# EAGLE design battery_monitor_6803-2_Rev5 (EAGLE 7.3.0)
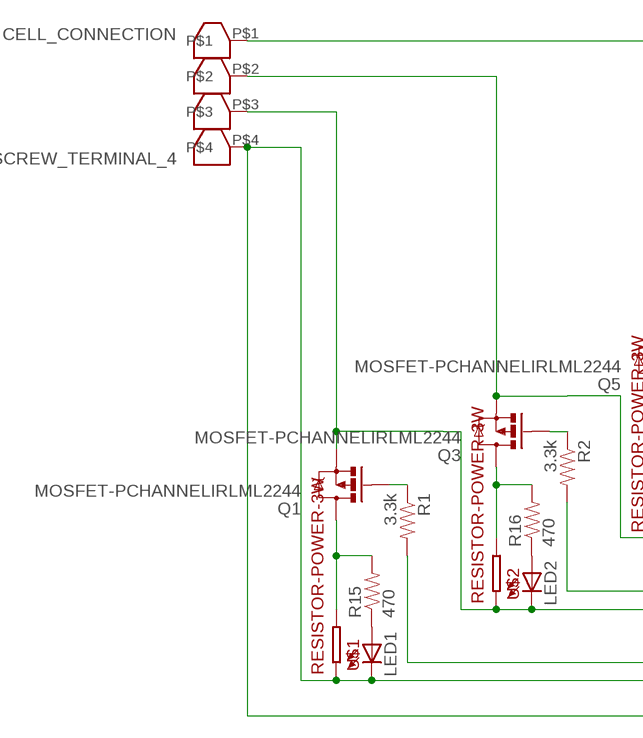
[diagram p0: schematic, sheet 1, part 1 of 2]
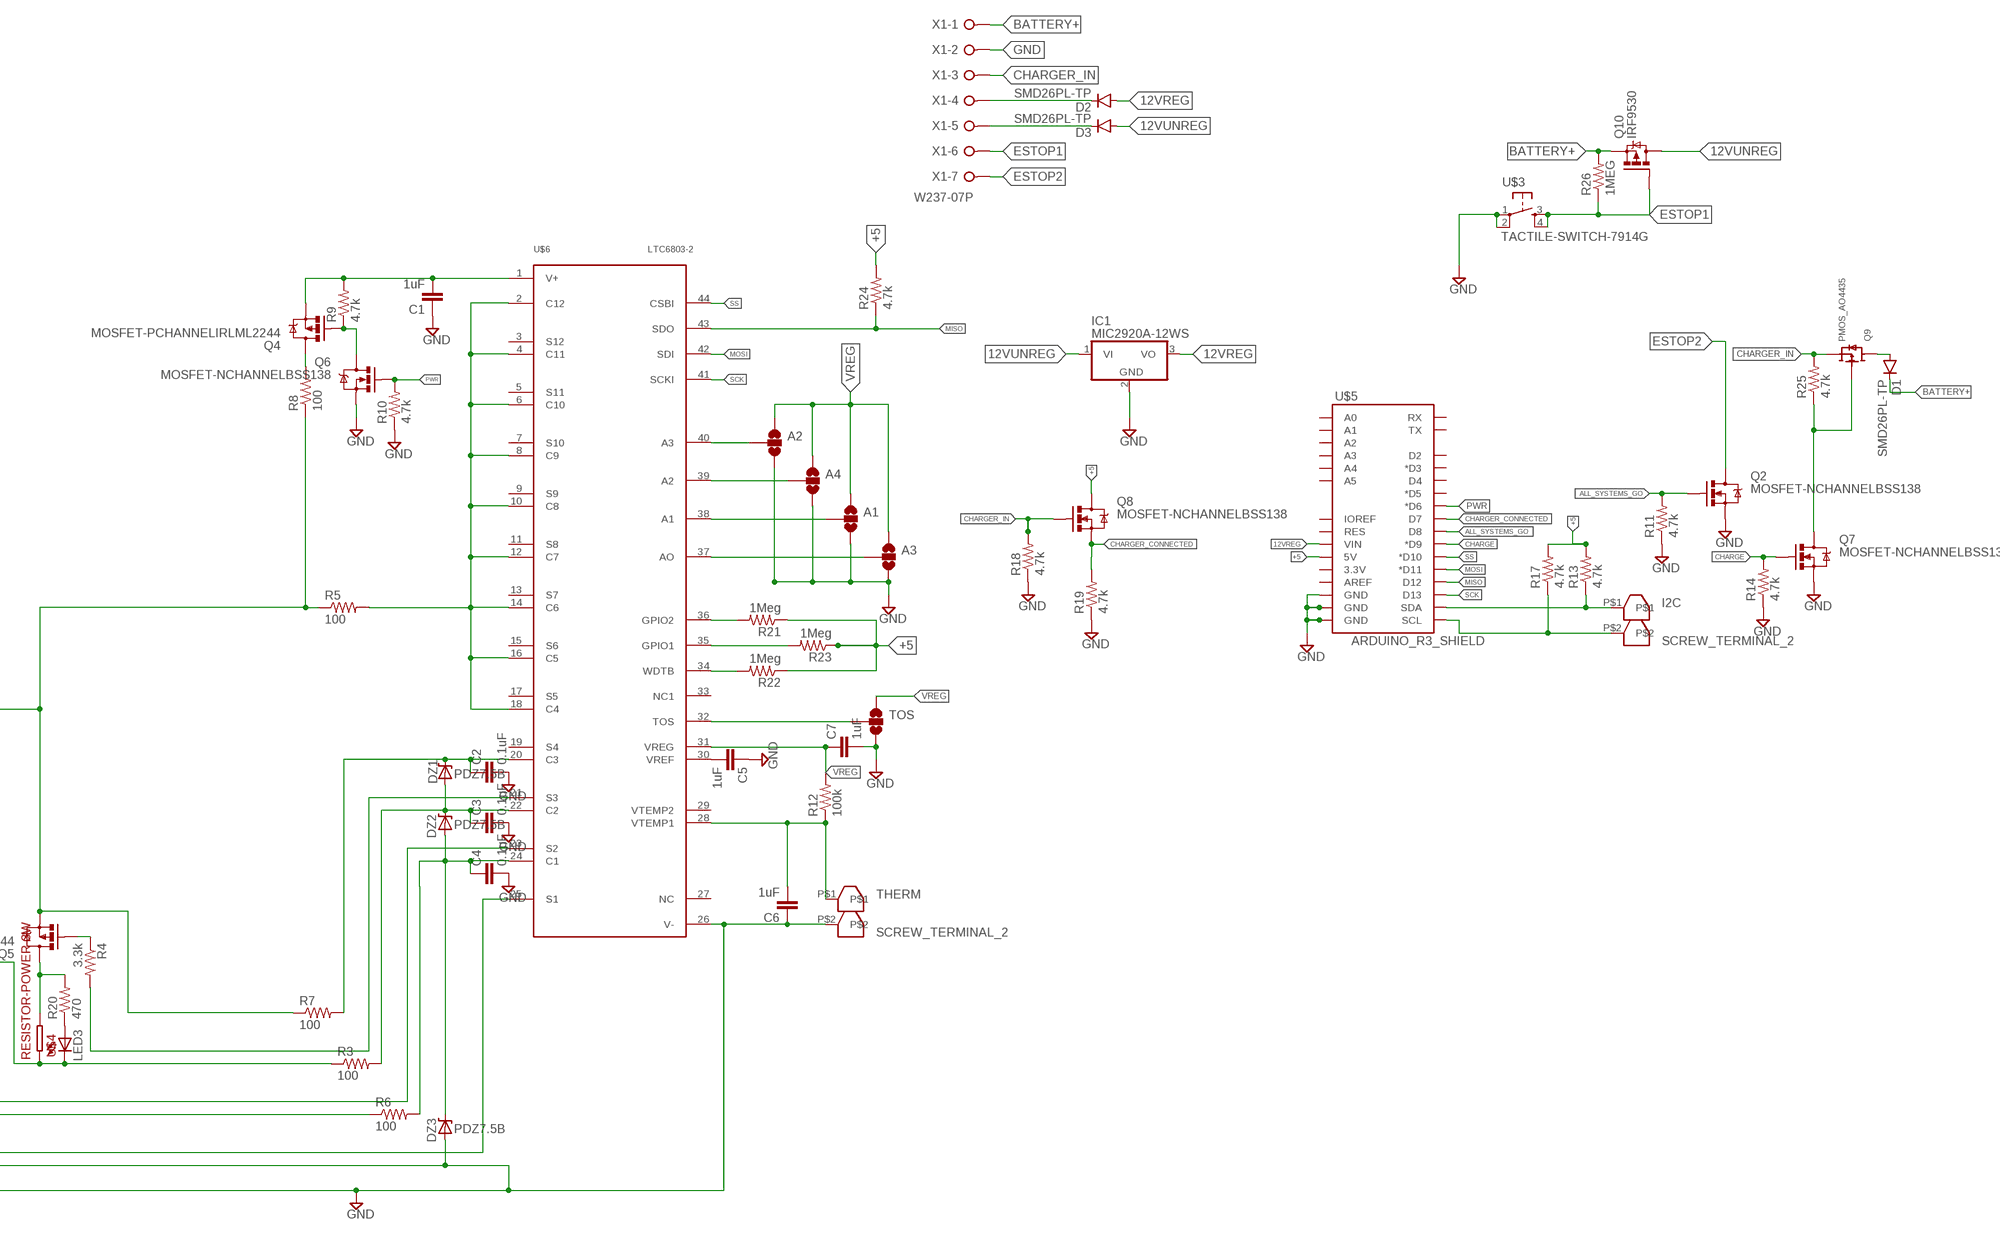
[diagram p1: schematic, sheet 1, part 2 of 2]

## Parts
A1  SOLDERJUMPER_2WAYS  [SJ_3]
A2  SOLDERJUMPER_2WAYS  [SJ_3]
A3  SOLDERJUMPER_2WAYS  [SJ_3]
A4  SOLDERJUMPER_2WAYS  [SJ_3]
C1  1uF  0.1UF-100V-10%(0603)  [0603-CAP]
C2  0.1uF  0.1UF-100V-10%(0603)  [0603-CAP]
C3  0.1uF  0.1UF-100V-10%(0603)  [0603-CAP]
C4  0.1uF  0.1UF-100V-10%(0603)  [0603-CAP]
C5  1uF  0.1UF-100V-10%(0603)  [0603-CAP]
C6  1uF  0.1UF-100V-10%(0603)  [0603-CAP]
C7  1uF  0.1UF-100V-10%(0603)  [0603-CAP]
CELL_CONNECTION  SCREW_TERMINAL_4  [SCREW_TERMINAL_4]
D1  SMD26PL-TP  DIODESOD123  [SOD-123]
D2  SMD26PL-TP  DIODESOD123  [SOD-123]
D3  SMD26PL-TP  DIODESOD123  [SOD-123]
DZ1  PDZ7.5B  DIODE-ZENER-BZT52  [SOD-323@1]
DZ2  PDZ7.5B  DIODE-ZENER-BZT52  [SOD-323@1]
DZ3  PDZ7.5B  DIODE-ZENER-BZT52  [SOD-323@1]
I2C  SCREW_TERMINAL_2  [SCREW_TERMINAL_2]
IC1  MIC2920A-12WS  MCP1703DB  [SOT223]
LED1  LED0603  [LED-0603]
LED2  LED0603  [LED-0603]
LED3  LED0603  [LED-0603]
Q1  MOSFET-PCHANNELIRLML2244  [SOT23-3@1]
Q2  MOSFET-NCHANNELBSS138  [SOT23]
Q3  MOSFET-PCHANNELIRLML2244  [SOT23-3@1]
Q4  MOSFET-PCHANNELIRLML2244  [SOT23-3@1]
Q5  MOSFET-PCHANNELIRLML2244  [SOT23-3@1]
Q6  MOSFET-NCHANNELBSS138  [SOT23]
Q7  MOSFET-NCHANNELBSS138  [SOT23]
Q8  MOSFET-NCHANNELBSS138  [SOT23]
Q9  PMOS_AO4435  [SOIC8]
Q10  IRF9530  [TO220BV]
R1  3.3k  3.3KOHM1/10W1%(0603)  [0603-RES]
R2  3.3k  3.3KOHM1/10W1%(0603)  [0603-RES]
R3  100  3.3KOHM1/10W1%(0603)  [0603-RES]
R4  3.3k  3.3KOHM1/10W1%(0603)  [0603-RES]
R5  100  3.3KOHM1/10W1%(0603)  [0603-RES]
R6  100  3.3KOHM1/10W1%(0603)  [0603-RES]
R7  100  3.3KOHM1/10W1%(0603)  [0603-RES]
R8  100  3.3KOHM1/10W1%(0603)  [0603-RES]
R9  4.7k  3.3KOHM1/10W1%(0603)  [0603-RES]
R10  4.7k  3.3KOHM1/10W1%(0603)  [0603-RES]
R11  4.7k  3.3KOHM1/10W1%(0603)  [0603-RES]
R12  100k  3.3KOHM1/10W1%(0603)  [0603-RES]
R13  4.7k  3.3KOHM1/10W1%(0603)  [0603-RES]
R14  4.7k  3.3KOHM1/10W1%(0603)  [0603-RES]
R15  470  3.3KOHM1/10W1%(0603)  [0603-RES]
R16  470  3.3KOHM1/10W1%(0603)  [0603-RES]
R17  4.7k  3.3KOHM1/10W1%(0603)  [0603-RES]
R18  4.7k  3.3KOHM1/10W1%(0603)  [0603-RES]
R19  4.7k  3.3KOHM1/10W1%(0603)  [0603-RES]
R20  470  3.3KOHM1/10W1%(0603)  [0603-RES]
R21  1Meg  3.3KOHM1/10W1%(0603)  [0603-RES]
R22  1Meg  3.3KOHM1/10W1%(0603)  [0603-RES]
R23  1Meg  3.3KOHM1/10W1%(0603)  [0603-RES]
R24  4.7k  3.3KOHM1/10W1%(0603)  [0603-RES]
R25  4.7k  3.3KOHM1/10W1%(0603)  [0603-RES]
R26  1MEG  3.3KOHM1/10W1%(0603)  [0603-RES]
THERM  SCREW_TERMINAL_2  [SCREW_TERMINAL_2]
TOS  SOLDERJUMPER_2WAYS  [SJ_3]
U$1  RESISTOR-POWER-3W  [RESISTOR-3W]
U$2  RESISTOR-POWER-3W  [RESISTOR-3W]
U$3  TACTILE-SWITCH-7914G  [7914G]
U$4  RESISTOR-POWER-3W  [RESISTOR-3W]
U$5  ARDUINO_R3_SHIELD  [UNO_R3_SHIELD]
U$6  LTC6803-2  [FSOP-44]
X1  W237-07P  [W237-7P]

## Nets
12VREG: D2.A IC1.3(VO) U$5.VIN
12VUNREG: D3.A IC1.1(VI) Q10.D
+5: Q8.3(D) R13.2 R17.2 R21.1 R22.1 R23.1 R24.2 U$5.5V
ALL_SYSTEMS_GO: Q2.1(G) R11.2 U$5.D8
BATTERY+: D1.C Q10.S R26.2 X1.1
CHARGE: Q7.1(G) R14.2 U$5.D9(*D9)
CHARGER_CONNECTED: Q8.2(S) R19.2 U$5.D7
CHARGER_IN: Q8.1(G) Q9.1(SOURCE) Q9.2(SOURCE) Q9.3(SOURCE) R18.2 R25.2 X1.3
ESTOP1: Q10.G R26.1 U$3.3 U$3.4 X1.6
ESTOP2: Q2.3(D) X1.7
GND: A1.3 A2.3 A3.3 A4.3 C1.1 C2.2 C3.2 C4.2 C5.1 C6.1 C7.2 CELL_CONNECTION.P$4 DZ3.2(A) IC1.2(GND) LED1.C Q2.2(S) Q6.2(S) Q7.2(S) R10.1 R11.1 R14.1 R18.1 R19.1 THERM.P$2 TOS.3 U$1.P$2 U$3.1 U$3.2 U$5.GND@0(GND) U$5.GND@1(GND) U$5.GND@2(GND) U$6.26(V-) X1.2
MISO: R24.1 U$5.D12 U$6.43(SDO)
MOSI: U$5.D11(*D11) U$6.42(SDI)
N$1: Q7.3(D) Q9.4(GATE) R25.1
N$2: CELL_CONNECTION.P$3 LED2.C Q1.2(S) R6.1 U$2.P$2
N$3: CELL_CONNECTION.P$2 LED3.C Q3.2(S) R3.1 U$4.P$2
N$4: CELL_CONNECTION.P$1 Q5.2(S) R5.1 R7.1 R8.1
N$5: Q1.3(D) R15.2 U$1.P$1
N$6: R2.2 U$6.23(S2)
N$7: Q1.1(G) R1.1
N$8: R1.2 U$6.25(S1)
N$9: R4.2 U$6.21(S3)
N$10: Q3.3(D) R16.2 U$2.P$1
N$11: Q3.1(G) R2.1
N$12: Q5.3(D) R20.2 U$4.P$1
N$13: LED1.A R15.1
N$14: C2.1 DZ1.1(C) R7.2 U$6.20(C3)
N$15: C4.1 DZ2.2(A) DZ3.1(C) R6.2 U$6.24(C1)
N$16: C3.1 DZ1.2(A) DZ2.1(C) R3.2 U$6.22(C2)
N$17: R5.2 U$6.2(C12) U$6.4(C11) U$6.6(C10) U$6.8(C9) U$6.10(C8) U$6.12(C7) U$6.14(C6) U$6.16(C5) U$6.18(C4)
N$18: Q4.3(D) R8.2
N$19: C1.2 Q4.2(S) R9.2 U$6.1(V+)
N$20: Q4.1(G) Q6.3(D) R9.1
N$21: C6.2 R12.1 THERM.P$1 U$6.28(VTEMP1)
N$22: LED2.A R16.1
N$23: LED3.A R20.1
N$24: R21.2 U$6.36(GPIO2)
N$25: R23.2 U$6.35(GPIO1)
N$26: D3.C X1.5
N$27: R22.2 U$6.34(WDTB)
N$28: A2.2 U$6.40(A3)
N$29: Q5.1(G) R4.1
N$30: A4.2 U$6.39(A2)
N$31: A1.2 U$6.38(A1)
N$32: A3.2 U$6.37(AO)
N$33: TOS.2 U$6.32(TOS)
N$34: C5.2 U$6.30(VREF)
N$$8: D1.A Q9.5(DRAIN) Q9.6(DRAIN) Q9.7(DRAIN) Q9.8(DRAIN)
PWR: Q6.1(G) R10.2 U$5.D6(*D6)
SCK: U$5.D13 U$6.41(SCKI)
SCL: I2C.P$2 R17.1 U$5.SCL
SDA: I2C.P$1 R13.1 U$5.SDA
SS: U$5.D10(*D10) U$6.44(CSBI)
VREG: A1.1 A2.1 A3.1 A4.1 C7.1 R12.2 TOS.1 U$6.31(VREG)
WIRE: D2.C X1.4
Unconnected: U$5.3.3V U$5.A0 U$5.A1 U$5.A2 U$5.A3 U$5.A4 U$5.A5 U$5.AREF U$5.D2 U$5.D3(*D3) U$5.D4 U$5.D5(*D5) U$5.IOREF U$5.RES U$5.RX U$5.TX U$6.3(S12) U$6.5(S11) U$6.7(S10) U$6.9(S9) U$6.11(S8) U$6.13(S7) U$6.15(S6) U$6.17(S5) U$6.19(S4) U$6.27(NC) U$6.29(VTEMP2) U$6.33(NC1)

## Library data of the parts
A1-A4 TOS = SparkFun:SOLDERJUMPER_2WAY: Solder Jumper 2 way solder jumper; OC_NEWARK: unknown
C1 C5-C7 = SparkFun-Capacitors:0.1UF-100V-10%(0603): CAP-08390; MPN: C0603X5R0J105M030BC; OC_NEWARK: 04X3184; PROD_ID: CAP-08390; VALUE: 0.1uF
C2-C4 = SparkFun-Capacitors:0.1UF-100V-10%(0603): CAP-08390; MF: AVX CORPORATION; MPN: 0603YG104ZAT2A; OC_NEWARK: 01H6821; PROD_ID: CAP-08390
CELL_CONNECTION = isaac1:SCREW_TERMINAL_4; MF: TYCO ELECTRONICS; MPN: 282834-4; OC_NEWARK: 12H8388
D1-D3 = SparkFun-DiscreteSemi:DIODE: Diode These are standard reverse protection diodes and small signal diodes. SMA package can handle up to about 1A. SOD-323 can handle about 200mA. What the SOD-323 package when ordering, there are some mfgs out there that are 5-pin packages.
DZ1-DZ3 = SparkFun-DiscreteSemi:DIODE-ZENER: Zener Diode Production Part - 8199 3.4V Zener Voltage; MPN: PDZ7.5B,115; OC_NEWARK: 04X4941
I2C THERM = isaac1:SCREW_TERMINAL_2; MF: TYCO ELECTRONICS; MPN: 282834-2; OC_NEWARK: 12H8386
IC1 = linear:MCP1703: 250 mA, 16V, Low Quiescent Current LDO Regulator Source: http://ww1.microchip.com/downloads/en/DeviceDoc/22049b.pdf
LED1-LED3 = SparkFun-LED:LED: LEDs Standard schematic elements and footprints for 5mm, 3mm, 1206, and 0603 sized LEDs. 5mm - Spark Fun Electronics SKU : COM-00529 (and others); MPN: 150060RS75000; OC_NEWARK: 95W3795
Q1 Q3-Q5 = SparkFun-DiscreteSemi:MOSFET-PCHANNEL: Generic PMOSFET; MPN: SI2369DS-T1-GE3; OC_NEWARK: 40X8697; PROD_ID: TRANS-11153
Q2 Q6-Q8 = SparkFun-DiscreteSemi:MOSFET-NCHANNEL: Common NMOSFET Parts MFG P/N Store ID Prod ID FDD8780 TRANS-09984 SI7820DN TRANS-11055 FDS6630A IC-08089 2N7002PW TRANS-11151 FQP30N06L COM-10213 TRANS-10060 BSS123LT1G TRANS-08345 BSS138 TRANS-00830 BS170 2N7000; MPN: IRLML0030TRPBF; OC_NEWARK: 52R2613; PROD_ID: TRANS-00830
Q9 = isaac1:PMOS_AO4435; MPN: SI9407BDY-T1-GE3; OC_NEWARK: 16P3885
Q10 = Adams Chips:IRF9530: P-CHANNEL HEXFET POWER-MOS-FET Source: http://www.irf.com/product-info/datasheets/data/irf9530.pdf; MPN: NTE2383; OC_NEWARK: 14T4215
R1 R2 R4 = SparkFun-Resistors:3.3KOHM1/10W1%(0603): RES-07851; MF: VISHAY/DALE; MPN: CRCW06033K00FKEA; OC_NEWARK: 52K8368; PROD_ID: RES-07851
R3 R5-R8 = SparkFun-Resistors:3.3KOHM1/10W1%(0603): RES-07851; MPN: ERJ-1GNF1000C; OC_NEWARK: 05X8794; PROD_ID: RES-07851
R9-R11 R13 R14 R17-R19 R24 R25 = SparkFun-Resistors:3.3KOHM1/10W1%(0603): RES-07851; MF: VISHAY/DALE; MPN: CRCW06034K70FKEA; OC_NEWARK: 52K8494; PROD_ID: RES-07851
R12 = SparkFun-Resistors:3.3KOHM1/10W1%(0603): RES-07851; MF: FARNELL; MPN: MC0063W06035100K; OC_NEWARK: 39K0075; PROD_ID: RES-07851
R15 R16 R20 = SparkFun-Resistors:3.3KOHM1/10W1%(0603): RES-07851; MPN: ERJ-P03F4700V; OC_NEWARK: 05X8640; PROD_ID: RES-07851
R21-R23 R26 = SparkFun-Resistors:3.3KOHM1/10W1%(0603): RES-07851; MPN: ERJ-3EKF1004V; OC_NEWARK: 64R5311; PROD_ID: RES-07851
U$1 U$2 U$4 = isaac1:RESISTOR-POWER-3W: PR03 series .205" dia x .657" L; MPN: ERG-3SJ200; OC_NEWARK: 52W7905
U$3 = GeekAmmo:TACTILE-SWITCH: Tactile Switch 4 Pins, SPST NO; MF: BOURNS, INC.; MPN: 7914G-1-000E; OC_NEWARK: 05B2757
U$5 = SparkFun-Boards:ARDUINO_R3_SHIELD: Shield form compatible with the Arduino Uno R3.; OC_NEWARK: unknown
U$6 = isaac1:LTC6803-2; OC_NEWARK: unknown
X1 = con-wago-508:W237-07P: WAGO SREW CLAMP; OC_FARNELL: unknown; OC_NEWARK: unknown

## Board
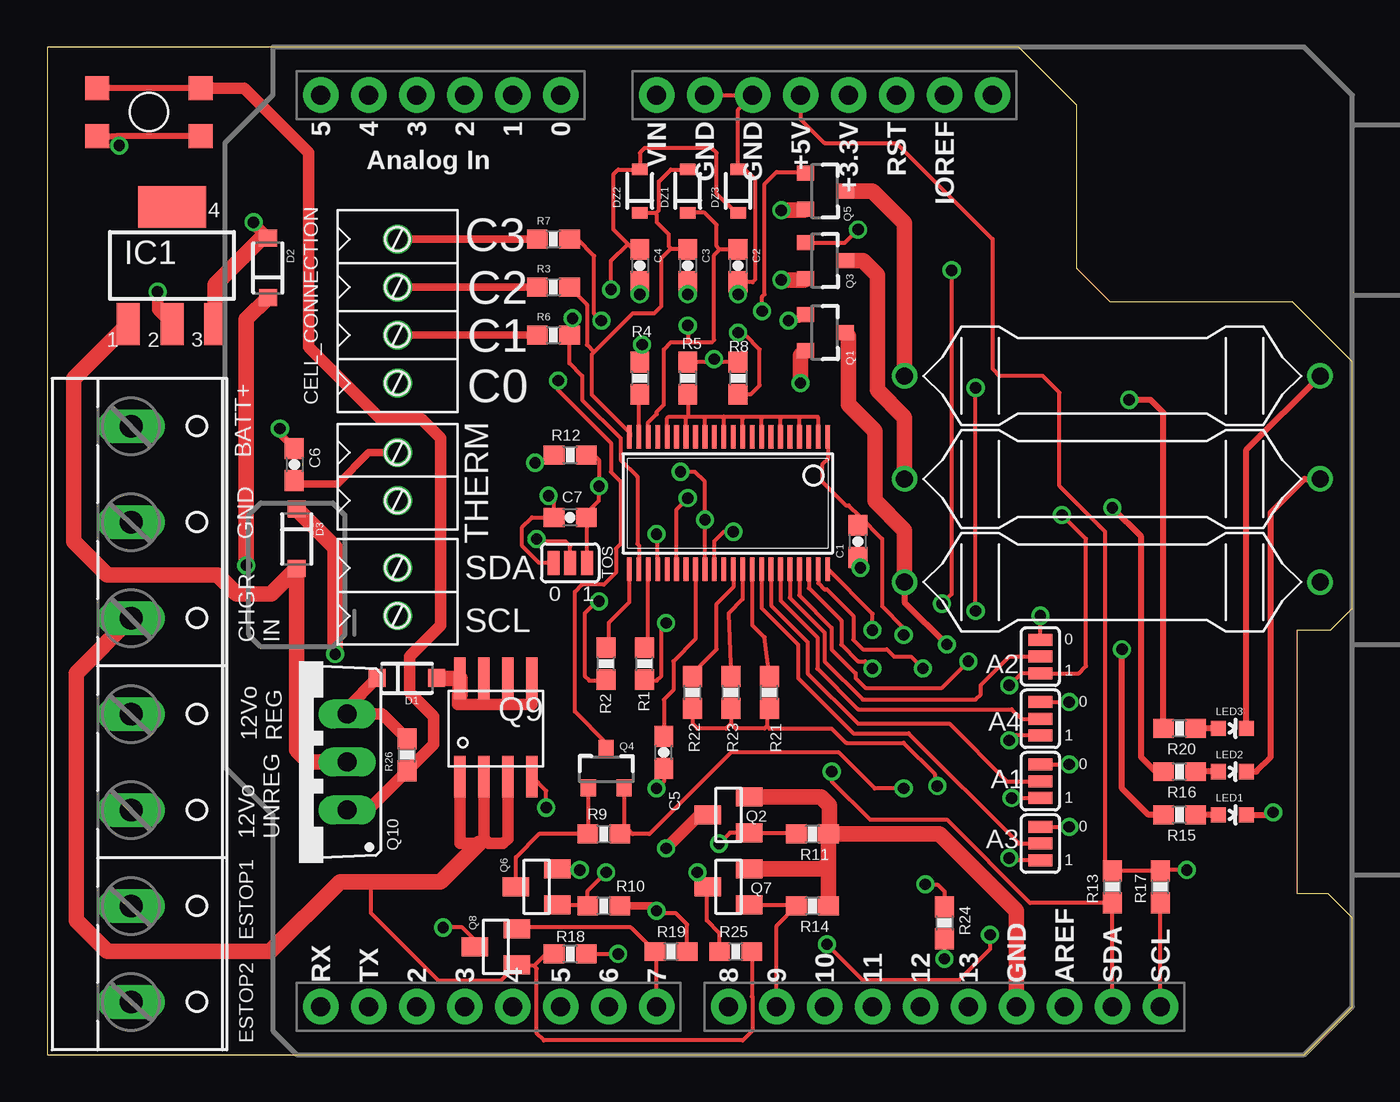
[diagram p2: board, top side]
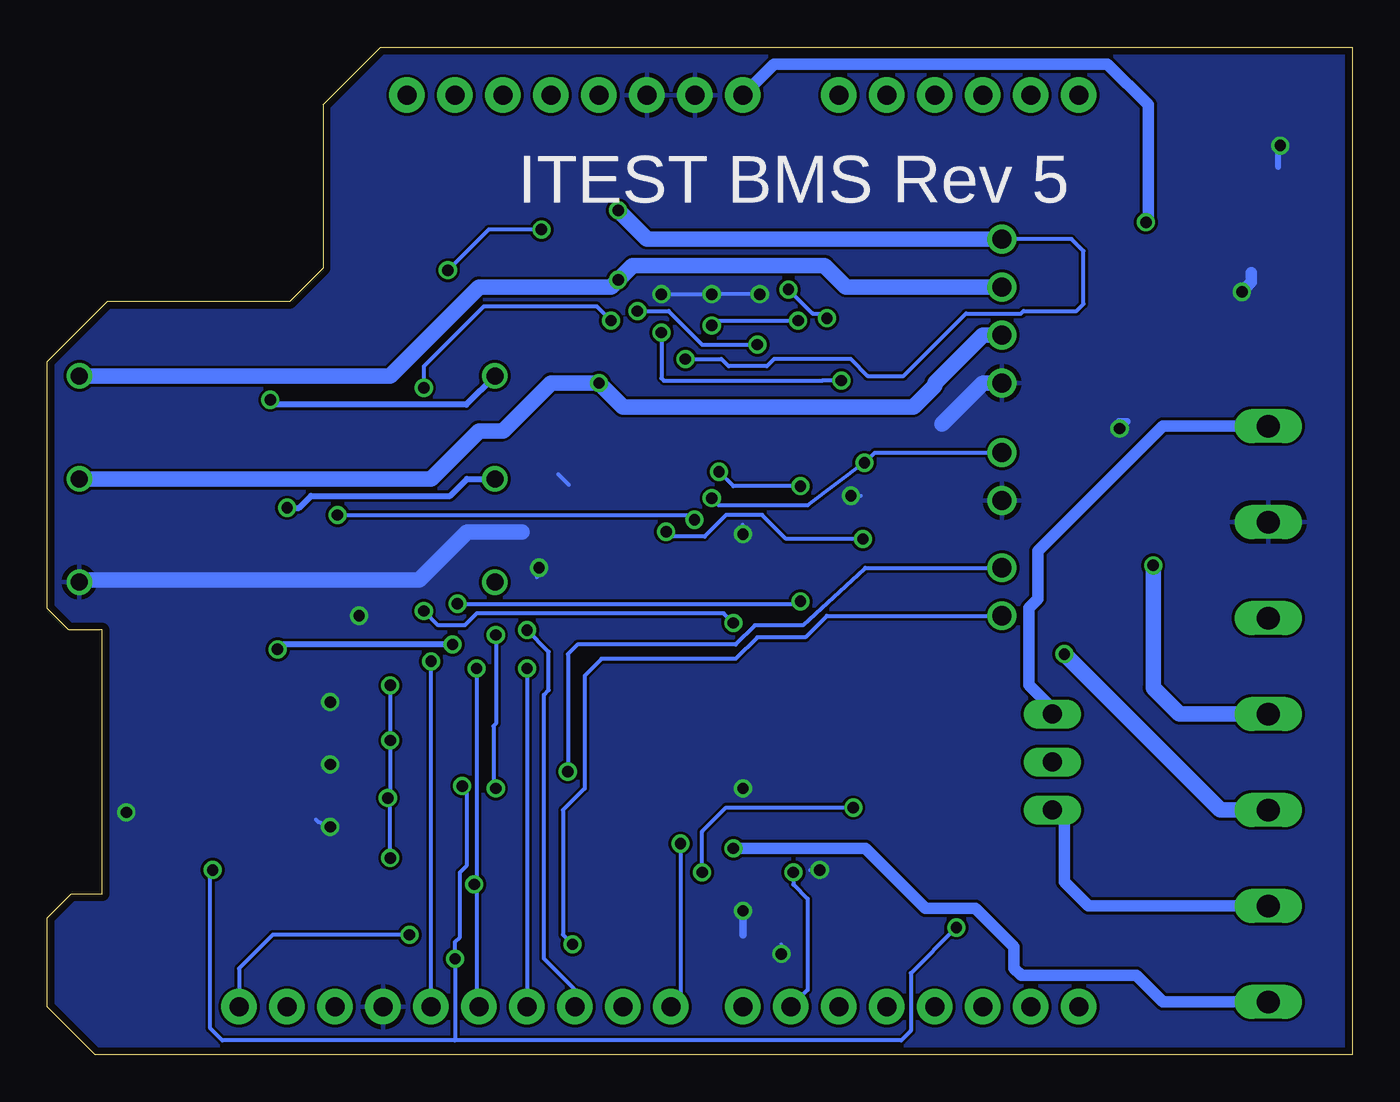
[diagram p3: board, bottom side, seen from below]

Size 69.09 x 53.34 mm. Coordinates in mm from the lower left corner, seen from the top.
Outline: 0,0 66.55,0 69.09,2.54 69.09,7.24 67.82,8.51 66.17,8.51 66.17,22.48 67.95,22.48 69.09,23.62 69.09,36.7 65.91,39.88 56.26,39.88 54.48,41.66 54.48,50.29 51.43,53.34 0,53.34 0,0
Copper layers (1*16): Top 0.0356mm / dielectric 1.5011mm / Bottom 0.0356mm
Design rules "LaenPCBOrder": minimum track width 6mil, minimum drill 13mil, track to track 6mil, track to pad 6mil, pad to pad 6mil, via to via 6mil, smd to smd 6mil, copper to edge 15mil, drill to drill 6mil, minimum pad ring 7mil, minimum via ring 7mil, stop-mask expansion 3mil, vias tented up to drill 0mil, thermal gap 10mil

### Footprints (pad centres in the part's own frame; a part is rotated, then mirrored left to right if it is on the bottom)
SJ_3 = smd 0.635 x 1.27: 1 -0.889,0; 2 0,0; 3 0.889,0
0603-CAP = smd 1.1 x 1: 1 -0.85,0; 2 0.85,0
SCREW_TERMINAL_4 = drill 1.016 pad 1.422: P$1 0,3.81; P$2 0,1.27; P$3 0,-1.27; P$4 0,-3.81
SOD-123 = smd 0.9 x 0.95: A 1.575,0; C -1.575,0
SOD-323@1 = smd 0.63 x 0.83: 1 -1.15,0; 2 1.15,0
SCREW_TERMINAL_2 = drill 1.016 pad 1.422: P$1 0,1.27; P$2 0,-1.27
SOT223 = smd 1.219 x 2.235: 1 -2.311,-3.099; 2 0,-3.099; 3 2.311,-3.099 | smd 3.6 x 2.2: 4 0,3.099
LED-0603 = smd 0.8 x 0.8: A 0,-0.75; C 0,0.75
SOT23-3@1 = smd 0.8 x 0.9: 1 -0.95,-1; 2 0.95,-1; 3 0,1.1
SOT23 = smd 1 x 1.4: 1 -0.95,-1.1; 2 0.95,-1.1; 3 0,1.1
SOIC8 = smd 0.6 x 2.2: 1 -1.905,-2.54; 2 -0.635,-2.54; 3 0.635,-2.54; 4 1.905,-2.54; 5 1.905,2.66; 6 0.635,2.66; 7 -0.635,2.66; 8 -1.905,2.66
TO220BV = drill 1.016 long: D 0,-2.54; G -2.54,-2.54; S 2.54,-2.54
0603-RES = smd 1.1 x 1: 1 -0.85,0; 2 0.85,0
RESISTOR-3W = drill 0.9: P$1 0,11; P$2 0,-11
7914G = smd 1.27 x 1.27: 1 0,0; 2 0,5.486; 3 2.54,0; 4 2.54,5.486
UNO_R3_SHIELD = drill 1.016 pad 1.88: 3.3V 50.8,26.67; 5V 50.8,29.21; A0 50.8,41.91; A1 50.8,44.45; A2 50.8,46.99; A3 50.8,49.53; A4 50.8,52.07; A5 50.8,54.61; AREF 2.54,15.24; D2 2.54,49.53; D3 2.54,46.99; D4 2.54,44.45; D5 2.54,41.91; D6 2.54,39.37; D7 2.54,36.83; D8 2.54,33.02; D9 2.54,30.48; D10 2.54,27.94; D11 2.54,25.4; D12 2.54,22.86; D13 2.54,20.32; GND@0 50.8,31.75; GND@1 50.8,34.29; GND@2 2.54,17.78; IOREF 50.8,21.59; NC 50.8,19.05; RES 50.8,24.13; RX 2.54,54.61; SCL 2.54,10.16; SDA 2.54,12.7; TX 2.54,52.07; VIN 50.8,36.83
FSOP-44 = smd 0.25 x 1.25: 1 -5.25,-3.5; 2 -4.75,-3.5; 3 -4.25,-3.5; 4 -3.75,-3.5; 5 -3.25,-3.5; 6 -2.75,-3.5; 7 -2.25,-3.5; 8 -1.75,-3.5; 9 -1.25,-3.5; 10 -0.75,-3.5; 11 -0.25,-3.5; 12 0.25,-3.5; 13 0.75,-3.5; 14 1.25,-3.5; 15 1.75,-3.5; 16 2.25,-3.5; 17 2.75,-3.5; 18 3.25,-3.5; 19 3.75,-3.5; 20 4.25,-3.5; 21 4.75,-3.5; 22 5.25,-3.5; 23 5.25,3.5; 24 4.75,3.5; 25 4.25,3.5; 26 3.75,3.5; 27 3.25,3.5; 28 2.75,3.5; 29 2.25,3.5; 30 1.75,3.5; 31 1.25,3.5; 32 0.75,3.5; 33 0.25,3.5; 34 -0.25,3.5; 35 -0.75,3.5; 36 -1.25,3.5; 37 -1.75,3.5; 38 -2.25,3.5; 39 -2.75,3.5; 40 -3.25,3.5; 41 -3.75,3.5; 42 -4.25,3.5; 43 -4.75,3.5; 44 -5.25,3.5
W237-7P = drill 1.194 long: 1 -15.24,-0.635; 2 -10.16,-0.635; 3 -5.08,-0.635; 4 0,-0.635; 5 5.08,-0.635; 6 10.16,-0.635; 7 15.24,-0.635

### Placement (x,y rotation side)
A1  52.58,14.48 90 top
A2  52.58,21.08 90 top
A3  52.58,11.18 90 top
A4  52.58,17.78 90 top
C1  42.93,27.18 90 top
C2  36.58,41.78 270 top
C3  33.91,41.78 270 top
C4  31.37,41.78 270 top
C5  32.64,16 90 top
C6  13.08,31.24 270 top
C7  27.69,28.45 180 top
CELL_CONNECTION  18.54,39.37 0 top
D1  19.05,19.94 0 top
D2  11.68,41.66 90 top
D3  13.21,27.3 270 top
DZ1  33.91,45.72 90 top
DZ2  31.37,45.72 90 top
DZ3  36.58,45.72 90 top
I2C  18.54,24.51 0 top
IC1  6.6,41.78 0 top
LED1  62.74,12.7 270 top
LED2  62.74,14.99 270 top
LED3  62.74,17.27 270 top
Q1  41.15,38.23 270 top
Q2  36.07,12.7 90 top
Q3  41.15,42.04 270 top
Q4  29.59,15.11 0 top
Q5  41.15,45.72 270 top
Q6  25.91,8.89 90 top
Q7  36.07,8.89 90 top
Q8  23.75,5.71 90 top
Q9  23.75,17.27 0 top
Q10  13.34,15.49 90 top
R1  31.62,20.7 90 top
R2  29.59,20.7 90 top
R3  26.8,40.64 0 top
R4  31.37,35.81 270 top
R5  33.91,35.81 270 top
R6  26.8,38.1 0 top
R7  26.8,43.18 0 top
R8  36.58,35.81 270 top
R9  29.46,11.68 0 top
R10  29.46,7.87 180 top
R11  40.51,11.68 180 top
R12  27.69,31.75 0 top
R13  56.39,8.89 90 top
R14  40.51,7.87 180 top
R15  59.94,12.7 180 top
R16  59.94,14.99 180 top
R17  58.93,8.89 90 top
R18  27.69,5.33 180 top
R19  33.02,5.46 180 top
R20  59.94,17.27 180 top
R21  38.23,19.18 90 top
R22  34.16,19.18 90 top
R23  36.2,19.18 90 top
R24  47.5,6.98 270 top
R25  36.45,5.46 0 top
R26  19.05,15.88 90 top
THERM  18.54,30.61 0 top
TOS  27.69,26.04 180 top
U$1  56.39,25.02 90 top
U$2  56.39,30.48 90 top
U$3  8.13,48.64 90 top
U$4  56.39,35.94 90 top
U$5  69.09,0 90 top
U$6  36.07,29.21 180 top
X1  5.08,18.03 270 top

### Tracks (layer width: path | path; a pad name or v marks a point on that pad's centre or on a via)
12VREG  (via drill 0.6)
  Top 0.61: D2.A 10.92,43.99 v10.92,44.07
  Top 0.813: IC1.3 8.89,38.71 8.89,40.77 11.35,43.23 D2.A
  Bottom 0.61: v10.92,44.07 10.79,44.2 10.79,50.29 12.95,52.45 30.61,52.45 U$5.VIN
12VUNREG
  Top 0.813: Q10.D 13.84,15.49 13.21,16.13 D3.A 11.86,24.38 10.03,24.38 9.02,25.4 3.17,25.4 1.4,27.18 1.4,35.79 IC1.1
+5  (via drill 0.6)
  Top 0.203: U$5.5V 39.88,49.53 41.15,48.26 44.96,48.26 50.04,43.18 50.04,36.32 50.42,35.94 52.7,35.94 53.59,35.05 53.59,30.1 56.01,27.69 56.01,10.12 R13.2 R17.2 58.97,9.78 v60.32,9.78 | Q8.3 22.65,6.05 21.97,6.73 v20.95,6.73 | R24.2 v47.5,5.08 | R22.1 34.16,17.53 34.42,17.27 35.94,17.27 36.2,17.53 | 38.1,17.4 38.23,17.27 41.53,17.27 42.29,16.51 45.34,16.51 46.99,14.86 46.99,14.35 v47.12,14.22 | R21.1 38.1,18.2 38.1,17.4 | 38.1,17.4 37.97,17.27 36.45,17.27 36.2,17.53 | 36.2,18.07 R23.1 36.07,18.2 36.2,18.07 | 36.2,18.07 36.2,17.53
  Bottom 0.203: v60.32,9.78 60.45,9.65 60.45,1.4 59.82,0.76 47.5,0.76 | 47.5,0.76 23.88,0.76 23.37,1.27 23.37,4.32 v20.95,6.73 | 47.5,0.76 v47.5,5.08 47.5,5.97 47.24,6.22 47.24,9.65 46.86,10.03 46.86,13.97 v47.12,14.22
ALL_SYSTEMS_GO  (via drill 0.6)
  Top 0.203: 39.6,11.75 Q2.1 36.13,11.75 v35.56,11.18
  Top 0.813: 39.6,11.75 R11.2
  Bottom 0.203: v35.56,11.18 35.56,3.05 U$5.D8
BATTERY+
  Top 0.61: R26.2 17.74,18.03 Q10.S 15.88,18.34 D1.C
  Bottom 0.61: Q10.S 15.88,18.34 17.12,19.58 17.12,23.65 16.64,24.13 16.64,26.67 10.03,33.27 X1.1
CHARGE
  Top 0.203: Q7.1 39.6,7.94 R14.2 38.61,6.82 U$5.D9
CHARGER_CONNECTED
  Top 0.203: U$5.D7 32.26,5.37 R19.2 30.9,6.73 24.91,6.73 Q8.2
CHARGER_IN
  Top 0.203: R18.2 26.42,5.33 25.78,4.7 | 25.78,4.7 24.91,4.7 Q8.1 | R25.2 37.3,3.09 37.34,3.05 37.34,1.27 36.83,0.76 26.29,0.76 25.91,1.14 25.91,4.57 25.78,4.7 | Q8.1 24.79,4.83 | 17.14,9.14 17.14,7.49 20.7,3.94 24.02,3.94 Q8.1
  Top 0.61: Q9.1 21.84,11.18 22.86,11.18 23.11,11.43 | Q9.2 23.11,11.43 | Q9.3 24.38,11.43 24.13,11.18 23.37,11.18 23.11,11.43
  Top 0.813: 22.86,11.18 20.83,9.14 17.14,9.14 15.49,9.14 11.81,5.46 3.17,5.46 1.52,7.11 1.52,20.19 X1.3
ESTOP1
  Top 0.305: U$3.3 U$3.4
  Top 0.61: Q10.G 16.98,12.95 R26.1 20.45,16.42 20.45,17.91 19.18,19.18 19.18,21.08 20.83,22.73 20.83,32.64 19.81,33.66 17.65,33.66 13.84,37.46 13.84,47.75 10.41,51.18 U$3.3
  Bottom 0.61: Q10.G 15.24,12.32 15.24,9.14 13.97,7.87 X1.6
ESTOP2  (via drill 0.6)
  Top 0.61: Q2.3 34.54,12.7 v32.77,10.92
  Bottom 0.61: v32.77,10.92 25.78,10.92 22.61,7.75 19.94,7.75 17.91,5.71 17.91,4.57 17.53,4.19 11.43,4.19 10.03,2.79 X1.7
GND  (via drill 0.6)
  Top 0.203: C4.2 v31.37,40.26 | v33.91,40.26 C3.2 | v36.58,40.26 C2.2 36.62,40.89 37.34,40.89 37.46,41.02 37.46,46.35 36.95,46.87 DZ3.2 36.58,50.04 U$5.GND@0 U$5.GND@1 | Q6.2 27.2,9.65 28.07,9.65 v28.19,9.78 | R18.1 v30.23,5.33 | R19.1 33.87,6.9 33.27,7.49 32.38,7.49 v32.26,7.62 | U$6.26 32.32,27.5 v32.26,27.56 | A3.3 v54.1,12.06 | A1.3 v54.1,15.37 | A4.3 v54.1,18.67 | A2.3 v52.58,23.24 | C1.1 42.93,25.91 v43.05,25.78 | v26.54,29.59 26.84,29.3 C7.2 25.65,28.45 25.15,27.94 25.15,26.92 26.04,26.04 TOS.3 | C5.1 32.64,14.48 v32.26,14.1
  Top 0.305: LED1.C 64.77,12.7 v64.9,12.83 | U$3.1 3.68,48.64 | U$3.2 3.68,48.64 | 3.68,48.64 3.81,48.51 v3.81,48.13
  Top 0.406: R10.1 32,7.87 v32.26,7.62 | C6.1 12.32,32.85 v12.32,33.15
  Top 0.61: IC1.2 5.84,39.45 v5.84,40.39
  Top 0.813: R11.1 47.24,11.68 51.31,7.62 U$5.GND@2 | R14.1 41.36,10.16 | 41.36,10.16 R11.1 | Q7.2 41.04,9.84 41.36,10.16 | Q2.2 40.96,13.65 41.4,13.21 41.4,11.72 R11.1
  Bottom 0.203: v31.37,40.26 v33.91,40.26 v36.58,40.26 | 42.04,30.73 41.47,30.16 | v30.23,5.33 30.23,5.84 | v32.26,27.56 32.26,28.07 | v54.1,12.06 54.74,12.32 54.86,12.45 | v54.1,15.37 54.48,15.37 | v54.1,18.67 54.23,18.67 54.1,18.8 | v52.58,23.24 52.58,23.62 | v43.05,25.78 43.05,25.4 43.18,25.27 | v26.54,29.59 26.04,29.59 | v32.26,14.1 32.26,13.72 | v28.19,9.78 28.7,9.78
  Bottom 0.305: v3.81,48.13 3.94,48.01 3.94,46.99
  Bottom 0.406: v32.26,7.62 32.26,6.35 | v12.32,33.15 11.94,33.53 12.32,33.53
  Bottom 0.61: v5.84,40.39 5.33,40.89 5.33,41.4
  Bottom 0.813: CELL_CONNECTION.P$4 19.56,35.56 21.72,33.4 | 43.94,27.69 46.86,27.69 49.4,25.15 67.26,25.15 U$1.P$2
  pour Bottom: -1.14,-1.27 69.09,-1.27 69.09,54.61 -1.52,54.61
MISO  (via drill 0.6)
  Top 0.203: v46.35,20.45 45.72,21.08 44.83,21.08 44.45,21.46 43.18,21.46 42.67,21.97 42.67,23.24 41.27,24.64 41.15,24.64 40.82,24.97 U$6.43 | v46.48,9.02 47.12,9.02 47.5,8.64 R24.1
  Bottom 0.203: v46.35,20.45 46.35,9.14 | 46.35,9.14 46.35,2.67 U$5.D12 | v46.48,9.02 46.35,9.14
MOSI  (via drill 0.6)
  Top 0.203: v43.69,20.45 43.31,20.83 42.93,20.83 42.04,21.72 42.04,22.99 40.32,24.71 U$6.42
  Bottom 0.203: v43.69,20.45 U$5.D11
N$1  (via drill 0.6)
  Top 0.203: R25.1 35.6,6.44 34.92,7.11 34.92,8.85 | 34.92,8.85 Q7.3 | 34.92,8.85 34.92,9.14 v34.42,9.65 | v26.42,13.08 26.42,13.97 Q9.4
  Bottom 0.203: v34.42,9.65 34.42,11.81 33.15,13.08 v26.42,13.08
N$2  (via drill 0.6)
  Top 0.305: LED2.C 64.01,14.99 64.77,15.75 64.77,28.7 66.55,30.48 U$2.P$2
  Top 0.406: CELL_CONNECTION.P$3 R6.1
  Top 0.813: v39.88,35.56 39.88,37.01 Q1.2
  Bottom 0.813: CELL_CONNECTION.P$3 19.56,38.1 22.1,35.56 22.1,35.43 23.24,34.29 38.61,34.29 v39.88,35.56 42.42,35.56 44.96,33.02 46.23,33.02 48.77,30.48 U$2.P$2
N$3  (via drill 0.6)
  Top 0.305: LED3.C 63.49,32.04 U$4.P$2
  Top 0.406: CELL_CONNECTION.P$2 R3.1
  Top 0.813: v38.86,41.02 40.08,41.02 Q3.2
  Bottom 0.813: CELL_CONNECTION.P$2 26.8,40.64 27.94,41.78 38.1,41.78 v38.86,41.02 | 38.73,41.15 v38.86,41.02 | U$4.P$2 50.93,35.94 46.23,40.64 39.24,40.64 v38.86,41.02
N$4  (via drill 0.6)
  Top 0.203: R5.1 R8.1 35.47,36.66 v35.31,36.83
  Top 0.406: CELL_CONNECTION.P$1 R7.1
  Top 0.813: v38.86,44.7 40.08,44.7 Q5.2
  Bottom 0.203: v35.31,36.83 33.4,36.83 33.02,36.45 30.99,36.45 30.61,36.83 26.54,36.83 25.65,35.94 23.75,35.94 20.45,39.24 17.53,39.24 17.4,39.37 14.61,39.37 14.22,39.75 14.22,42.55 14.86,43.18 CELL_CONNECTION.P$1
  Bottom 0.813: CELL_CONNECTION.P$1 37.34,43.18 v38.86,44.7
N$5  (via drill 0.6)
  Top 0.305: R15.2 58.29,12.7 56.9,14.1 v56.9,21.46 | U$1.P$1 45.39,23.95 v47.62,21.72
  Top 0.813: U$1.P$1 45.39,27.76 43.81,29.34 43.81,33.02 42.42,34.42 42.42,38.06 Q1.3
  Bottom 0.305: v47.62,21.72 56.64,21.72 v56.9,21.46
N$6
  Top 0.203: R2.2 29.72,21.68 29.72,22.86 30.82,23.96 U$6.23
N$7  (via drill 0.6)
  Top 0.203: v49.15,23.5 v49.15,35.31 | v39.24,38.86 39.83,38.86 Q1.1 | R1.1 31.79,19.81 32.26,19.81 32.51,20.07 32.51,22.61 v32.77,22.86
  Bottom 0.203: v49.15,23.5 48.39,22.73 46.99,22.73 46.35,23.37 33.27,23.37 v32.77,22.86 | v49.15,35.31 49.15,36.45 45.97,39.62 40,39.62 v39.24,38.86
N$8
  Top 0.203: R1.2 31.82,21.62 U$6.25
N$9
  Top 0.203: U$6.21 31.32,34.91 R4.2
N$10  (via drill 0.6)
  Top 0.305: R16.2 58.67,14.99 57.91,15.75 57.91,27.43 v56.39,28.96
  Top 0.813: U$2.P$1 45.39,33.73 43.94,35.18 43.94,41.27 43.18,42.04 Q3.3
  Bottom 0.305: v56.39,28.96 55.75,28.96 55.12,29.59 47.75,29.59 46.86,30.48 U$2.P$1
N$11  (via drill 0.6)
  Top 0.203: Q3.1 42.23,42.99 v42.93,43.69 | v47.88,41.53 47.88,24.38 v47.37,23.88 | v29.21,24 29.08,24 28.45,23.37 28.45,20.07 28.7,19.81 29.55,19.81 R2.1
  Bottom 0.203: v42.93,43.69 45.72,43.69 v47.88,41.53 | v47.37,23.88 29.34,23.88 v29.21,24
N$12  (via drill 0.6)
  Top 0.305: R20.2 59.09,34 58.42,34.67 v57.28,34.67
  Top 0.813: U$4.P$1 45.39,44.02 43.69,45.72 Q5.3
  Bottom 0.305: U$4.P$1 46.91,34.42 57.02,34.42 v57.28,34.67
N$13
  Top 0.305: LED1.A R15.1
N$14  (via drill 0.6)
  Top 0.203: C2.1 35.6,42.63 | 35.6,42.63 35.43,42.8 35.43,43.94 34.8,44.58 DZ1.1 | 35.6,42.63 35.31,42.34 35.31,37.85 35.18,37.72 34.04,37.72 | 34.04,37.72 33.02,37.72 32.64,37.34 32.64,34.42 32.26,34.04 32.26,33.91 31.82,33.47 U$6.20 | v33.91,38.61 33.91,37.85 34.04,37.72 | v29.34,38.86 28.96,39.24 28.96,42.29 28.07,43.18 R7.2
  Bottom 0.203: v33.91,38.61 33.66,38.86 v29.34,38.86
N$15  (via drill 0.6)
  Top 0.203: DZ3.1 36.46,44.57 35.43,45.59 35.43,47.75 35.18,48.01 31.62,48.01 31.37,47.75 DZ2.2 30.23,46.86 29.97,46.61 29.97,43.69 30.73,42.93 | C4.1 31.03,42.63 30.73,42.93 | v29.84,40.51 29.84,42.04 30.73,42.93 | U$6.24 31.32,26.97 31.24,27.05 31.24,30.61 30.35,31.5 30.35,32.64 28.32,34.67 28.32,35.94 27.65,36.62 R6.2 27.65,38.82 v27.81,38.99
  Bottom 0.203: v29.84,40.51 28.57,39.24 28.07,39.24 v27.81,38.99
N$16
  Top 0.203: 30.82,32.94 28.83,34.92 28.83,37.08 28.96,37.21 | DZ2.1 32.14,44.57 | 32.14,44.57 32.26,44.45 32.26,44.07 32.89,43.43 32.89,42.8 33.02,42.67 | 33.02,42.67 33.87,42.67 C3.1 | 32.14,44.57 32.25,44.57 32.38,44.7 32.38,46.23 33.02,46.86 DZ1.2 | 33.02,42.67 32.51,42.16 32.51,39.62 32.13,39.24 30.99,39.24 28.96,37.21 | R3.2 28.57,39.71 28.57,37.59 28.96,37.21
  Top 0.254: 30.82,32.94 U$6.22
N$17
  Top 0.203: 33.78,33.78 32.89,33.78 32.82,33.71 U$6.18 | 33.78,33.78 33.91,33.78 | 33.91,33.78 34.8,33.78 | 34.8,33.78 35.81,33.78 | 35.81,33.78 36.7,33.78 | 36.7,33.78 36.83,33.78 | 36.83,33.78 37.72,33.78 | 37.72,33.78 38.73,33.78 | 38.73,33.78 39.75,33.78 | 39.75,33.78 40.77,33.78 40.82,33.73 U$6.2 | 39.75,33.78 39.82,33.71 U$6.4 | 38.73,33.78 38.82,33.7 U$6.6 | 37.72,33.78 37.82,33.68 U$6.8 | 36.82,33.77 36.83,33.78 | 33.78,33.78 33.82,33.75 U$6.16 | R5.2 33.91,33.78 | U$6.14 34.82,33.76 34.8,33.78 | U$6.12 35.82,33.78 35.81,33.78 | U$6.10 36.82,33.67 36.7,33.78
N$18  (via drill 0.6)
  Top 0.203: R8.2 37.25,34.96 37.72,35.43 37.72,37.34 36.96,38.1 36.7,38.1 v36.58,38.23 | Q4.3 29.59,16.51 27.94,18.16 27.94,24.51 28.32,24.89 29.46,24.89 30.1,25.53 30.1,26.8 30.35,27.05 30.35,30.35 29.84,30.86 29.84,32.38 27.05,35.18 v27.05,35.69
  Bottom 0.203: v36.58,38.23 36.58,35.81 36.45,35.69 28.07,35.69 v27.05,35.69
N$19  (via drill 0.6)
  Top 0.203: 42.99,28.51 42.42,29.08 42.29,29.08 41.02,30.35 41.02,31.24 41.32,31.54 U$6.1 | 42.99,28.51 44.2,27.3 44.2,23.75 45.34,22.61 v45.34,22.22 | v45.34,14.1 43.81,14.1 41.91,16 36.2,16 31.88,11.68 30.99,11.68 | 30.99,11.68 R9.2 | C1.2 42.93,28.45 42.99,28.51 | Q4.2 30.54,12.13 30.99,11.68
  Bottom 0.203: v45.34,22.22 45.34,17.53 45.47,17.4 45.47,14.22 v45.34,14.1
N$20
  Top 0.203: Q6.3 24.81,10.46 26.04,11.68 R9.1 28.64,11.71 Q4.1
N$21  (via drill 0.6)
  Top 0.203: U$6.28 33.32,28.87 v33.91,29.46 | R12.1 26.42,31.34 v25.82,31.34
  Top 0.406: C6.2 13.25,30.23 15.37,30.23 17.02,31.88 THERM.P$1
  Bottom 0.203: v25.82,31.34 25.78,31.37 25.53,31.62 | v25.82,31.34 28.83,29.08 33.53,29.08 v33.91,29.46 | 25.53,31.62 25.27,31.88 THERM.P$1 | v25.82,31.34 25.54,31.62 25.53,31.62
N$22
  Top 0.305: LED2.A R16.1
N$23
  Top 0.305: LED3.A R20.1
N$24
  Top 0.203: U$6.36 37.32,22.75 37.97,22.1 R21.2
N$25
  Top 0.203: U$6.35 36.82,24.12 36.07,23.37 R23.2
N$26  (via drill 0.6)
  Top 0.813: D3.C 15.24,26.85 v15.24,21.21
  Bottom 0.813: v15.24,21.21 6.98,12.95 X1.5
N$27
  Top 0.203: U$6.34 36.32,24.76 35.43,23.88 35.43,21.46 34.16,20.19 R22.2
N$28
  Top 0.203: U$6.40 39.32,24.18 41.15,22.35 41.15,20.83 43.18,18.8 49.15,18.8 49.4,19.05 49.4,19.56 50.93,21.08 A2.2
N$29  (via drill 0.6)
  Top 0.203: R4.1 31.37,37.46 v31.5,37.59 | v37.85,39.37 37.85,40.13 37.97,40.26 37.97,46.1 38.61,46.74 40.08,46.74 Q5.1
  Bottom 0.203: v37.85,39.37 36.2,39.37 34.42,37.59 v31.5,37.59
N$30
  Top 0.203: U$6.39 38.82,24.05 40.77,22.1 40.77,20.45 42.93,18.29 51.05,18.29 51.56,17.78 A4.2
N$31
  Top 0.203: U$6.38 38.32,23.79 40.26,21.84 40.26,20.19 42.93,17.53 47.75,17.53 50.8,14.48 A1.2
N$32
  Top 0.203: U$6.37 37.82,23.65 39.75,21.72 39.75,19.94 42.67,17.02 45.59,17.02 51.43,11.18 A3.2
N$33  (via drill 0.6)
  Top 0.203: TOS.2 27.69,26.92 27.43,27.18 26.04,27.18 v25.91,27.3 | v36.32,27.69 35.81,27.69 35.31,27.18 35.31,25.72 U$6.32
  Bottom 0.203: v25.91,27.3 29.97,27.3 31.24,28.57 33.15,28.57 34.29,27.43 36.07,27.43 v36.32,27.69
N$34
  Top 0.203: U$6.30 34.32,22 33.15,20.83 33.15,19.3 32.64,18.8 C5.2
N$$8
  Top 0.61: 21.84,19.05 21.72,19.05 21.72,18.54 23.11,18.54 | Q9.7 23.11,18.54 | 23.11,18.54 24.38,18.54 | Q9.6 24.38,18.54 | 24.38,18.54 25.65,18.54 Q9.5
  Top 0.813: D1.A Q9.8 21.84,19.05
PWR  (via drill 0.6)
  Top 0.203: Q6.1 28.55,7.94 R10.2 28.61,8.67 v29.59,9.65
  Bottom 0.203: v29.59,9.65 29.59,9.02 28.83,8.25 28.83,3.43 U$5.D6
SCK  (via drill 0.6)
  Top 0.203: U$6.41 39.82,24.32 41.53,22.61 41.53,21.46 42.8,20.19 42.8,19.94 43.31,19.43 47.37,19.43 v48.77,20.83
  Bottom 0.203: U$5.D13 v48.77,20.83
SCL  (via drill 0.6)
  Top 0.203: U$5.SCL R17.1 | v49.91,6.35 49.91,5.59 48.26,3.94 43.18,3.94 v41.27,5.84
  Bottom 0.203: v41.27,5.84 41.78,6.35 41.78,12.95 40.64,14.1 40.64,20.07 39.75,20.95 32.64,20.95 31.5,22.1 28.96,22.1 27.81,23.24 I2C.P$2 | v49.91,6.35 57.15,6.35 58.93,4.57 U$5.SCL
SDA  (via drill 0.6)
  Top 0.203: U$5.SDA R13.1 52.03,8.04 47.62,12.45 43.56,12.45 41.53,14.48 v41.53,14.99
  Bottom 0.203: v41.53,14.99 41.53,21.21 41.02,21.72 32.64,21.72 31.62,22.73 29.08,22.73 26.16,25.4 25.78,25.78 I2C.P$1
SS  (via drill 0.6)
  Top 0.203: v43.69,22.48 43.69,23.34 U$6.44
  Bottom 0.203: U$5.D10 41.15,3.43 42.8,5.08 42.8,19.05 42.55,19.3 42.55,21.34 v43.69,22.48
VREG  (via drill 0.6)
  Top 0.203: R12.2 28.96,31.75 29.21,31.5 v29.21,30.1 29.21,29.34 28.54,28.66 C7.1 28.57,28.41 TOS.1 | U$6.31 v34.82,28.32 34.82,30.33 34.29,30.86 v33.53,30.86 | A3.1 51.05,10.29 v50.93,10.41 | v51.05,13.59 A1.1 | A4.1 51.18,16.89 v50.93,16.64 | v50.93,19.56 51.56,20.19 A2.1 54.61,20.19 54.99,20.57 54.99,27.3 v53.72,28.57
  Bottom 0.203: v29.21,30.1 32.77,30.1 v33.53,30.86 | v50.93,10.41 50.93,13.46 v51.05,13.59 50.93,13.72 v50.93,16.64 v50.93,19.56 | v53.72,28.57 35.07,28.57 v34.82,28.32
WIRE  (via drill 0.6)
  Top 0.813: D2.C 10.54,38.94 v10.54,25.91
  Bottom 0.813: v10.54,25.91 10.54,19.43 9.14,18.03 X1.4

### Text on the board
tPlace: C3 | C2 | C1 | C0 | BATT+ | GND | SDA | 0 | 1 | CHGR / IN | SCL | 0 | 1 | 0 | 12Vo / REG | 1 | 0 | 1 | 0 | 12Vo / UNREG | 1 | ESTOP1 | ESTOP2
bNames: ITEST BMS Rev 5